# EAGLE schematic ARKnew (EAGLE 9.4.2)
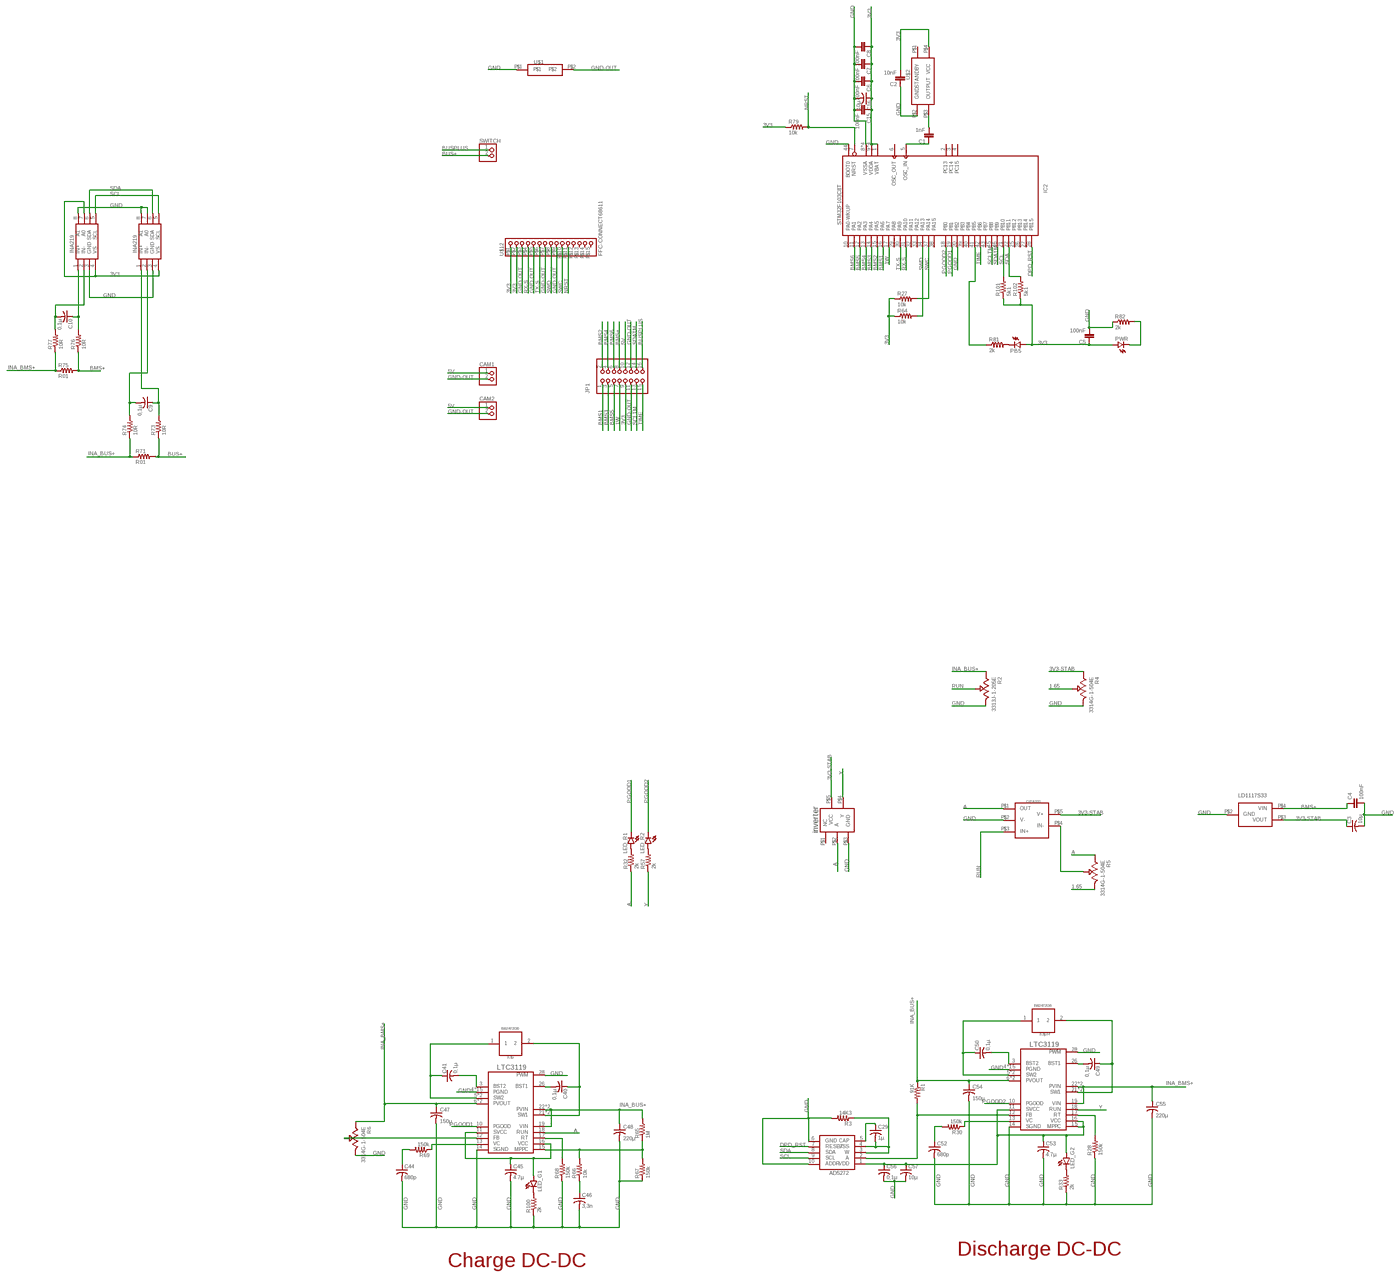
[diagram p0: schematic, sheet 1, overview]
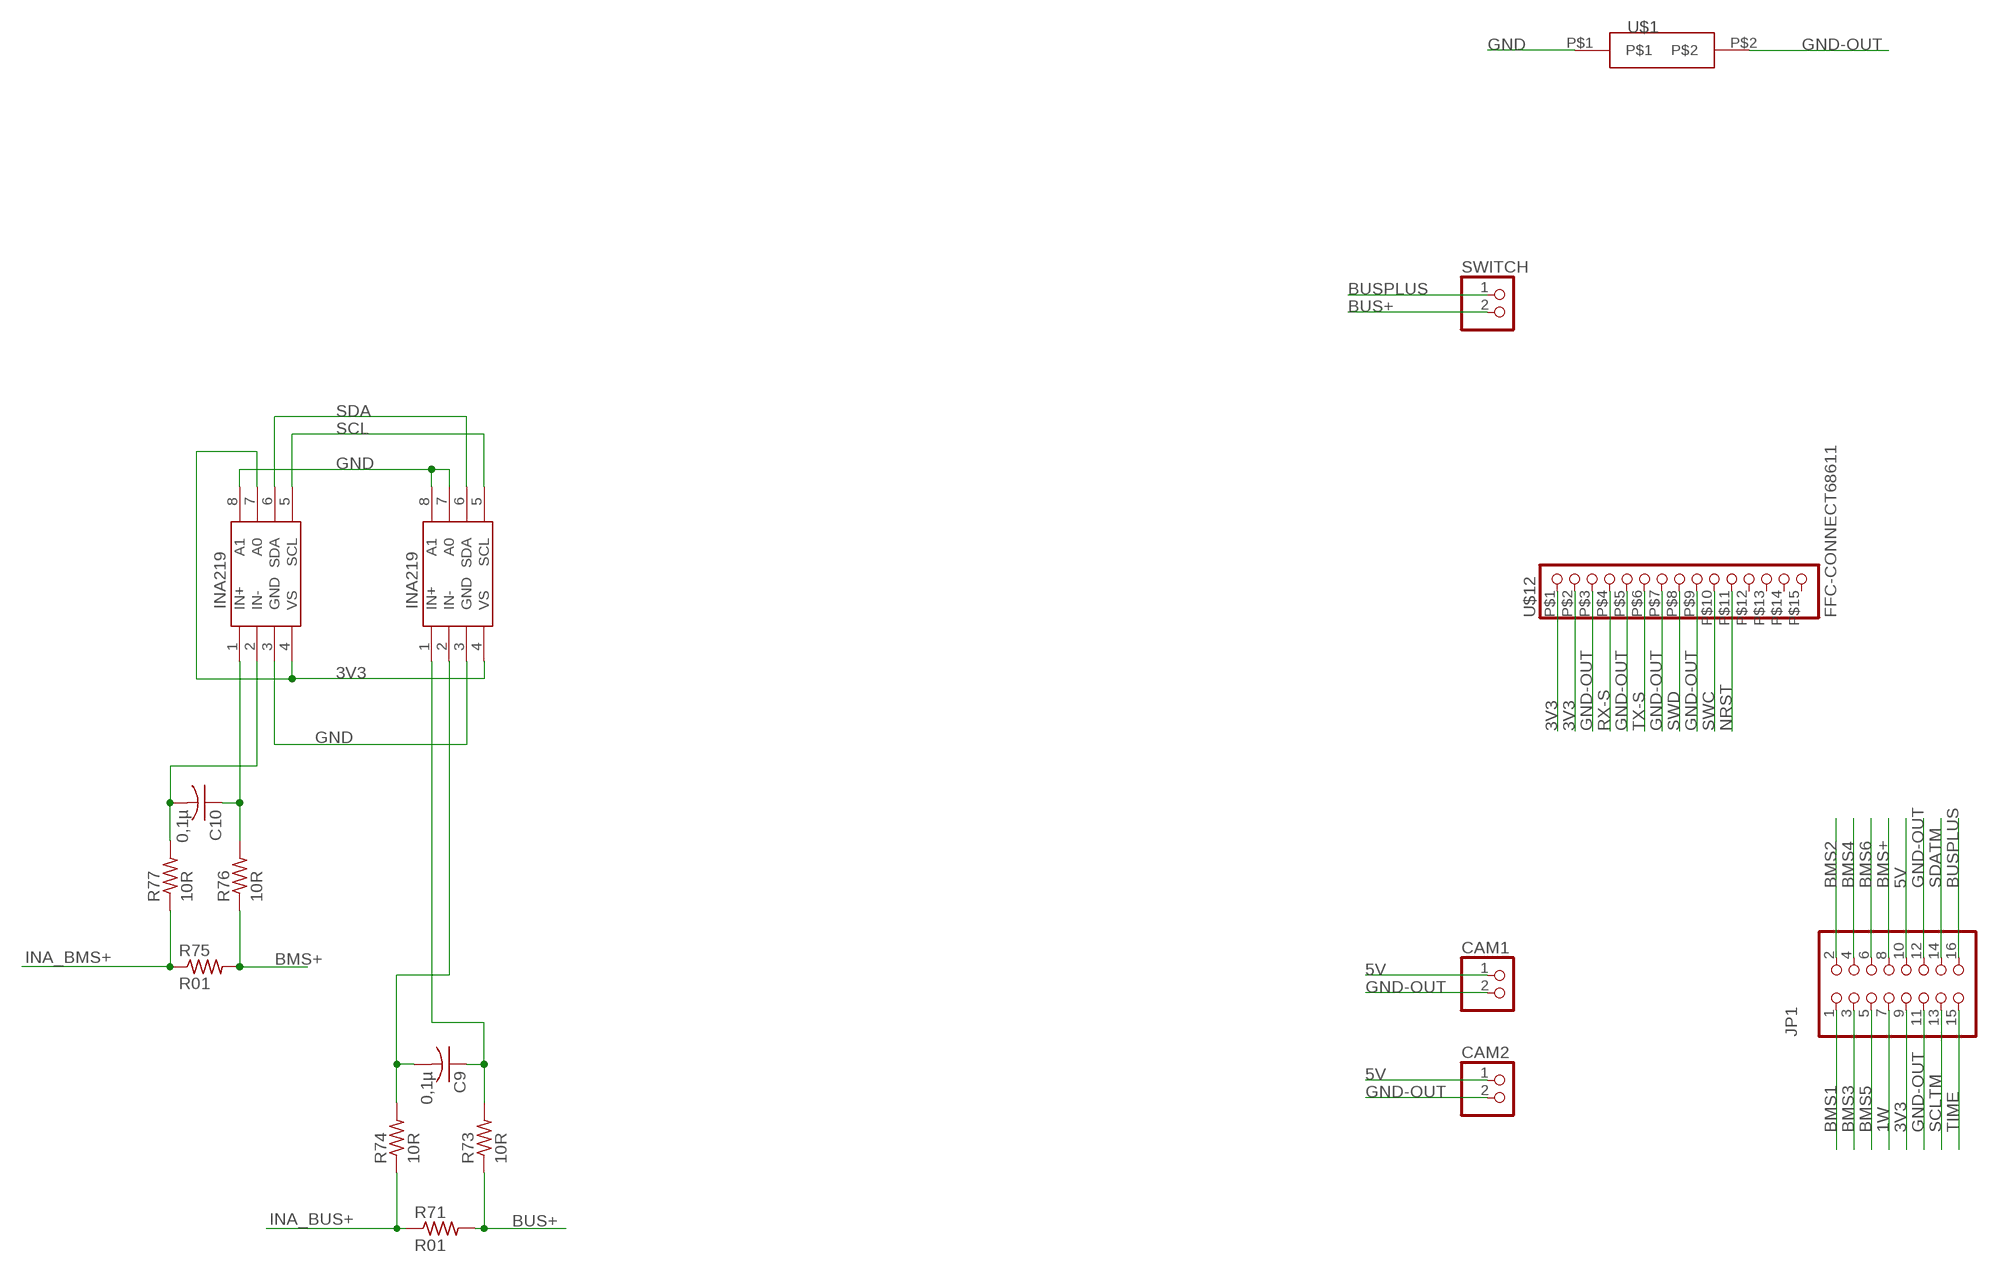
[diagram p1: schematic, sheet 1, part 1 of 4]
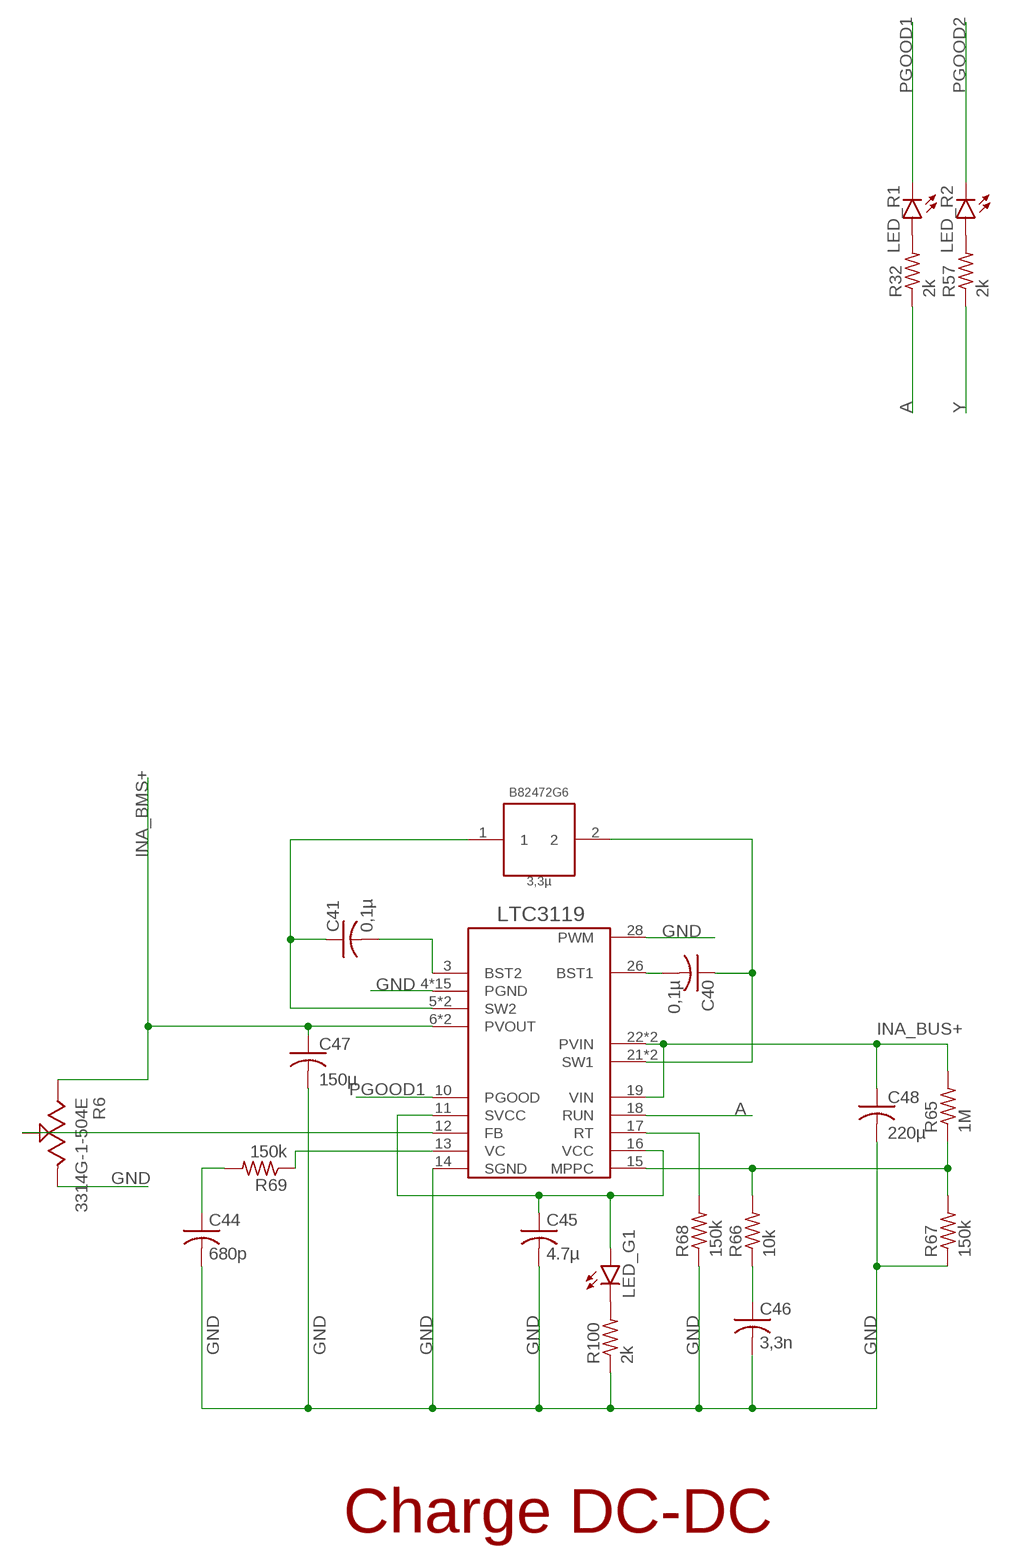
[diagram p2: schematic, sheet 1, part 2 of 4]
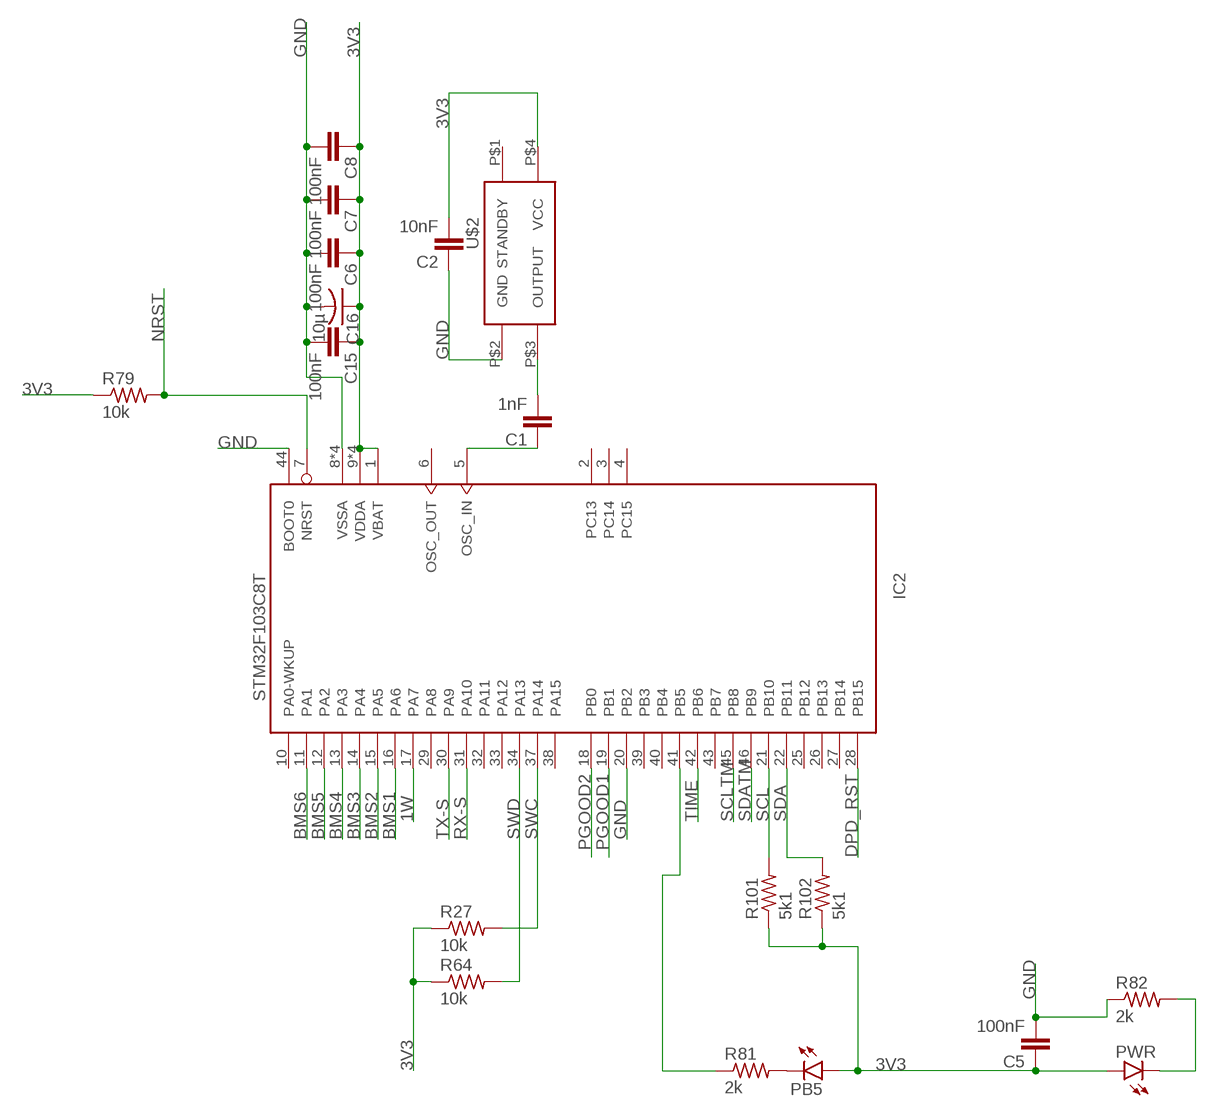
[diagram p3: schematic, sheet 1, part 3 of 4]
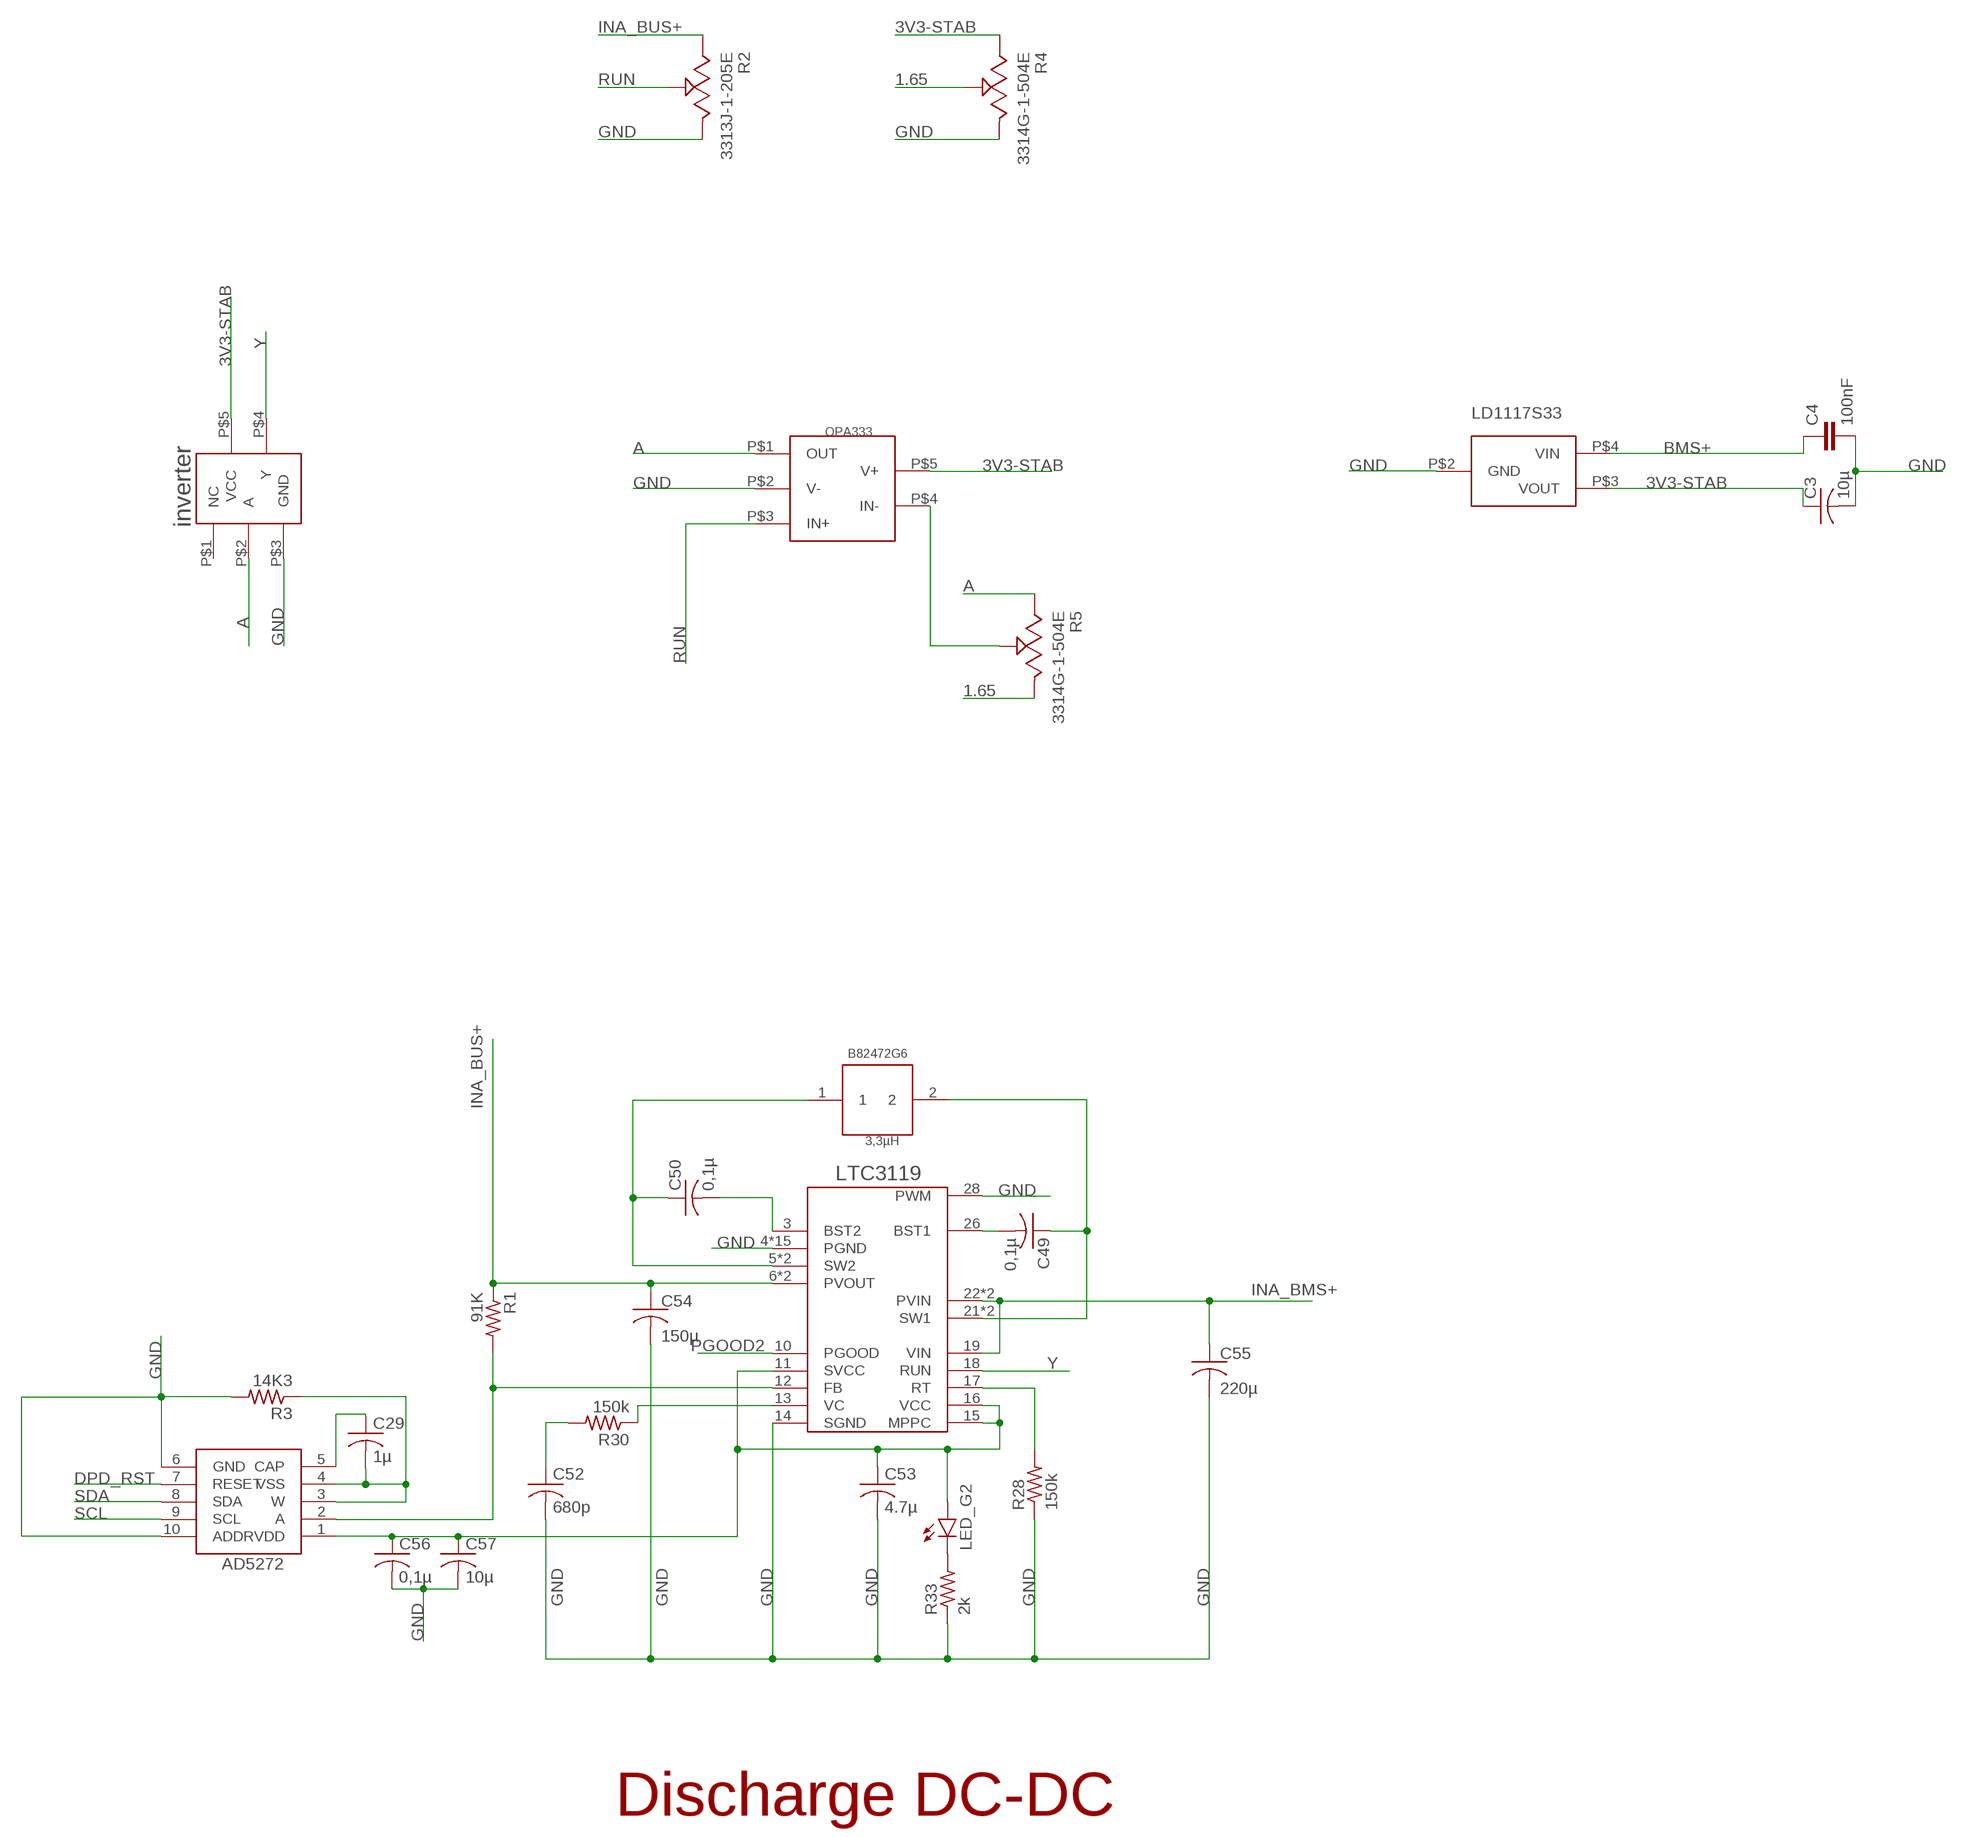
[diagram p4: schematic, sheet 1, part 4 of 4]

## Parts
3,3µH  3,3µ  B82472G6  [B82472G6]
3,3µH1  3,3µH  B82472G6  [B82472G6]
AD5272#2  AD5272  [MSOP10]
C1  1nF  C-EUC0603  [C0603]
C2  10nF  C-EUC0603  [C0603]
C3  10µ  C-USC1206  [C1206]
C4  100nF  C-EUC0603  [C0603]
C5  100nF  C-EUC0603  [C0603]
C6  100nF  C-EUC0603  [C0603]
C7  100nF  C-EUC0603  [C0603]
C8  100nF  C-EUC0603  [C0603]
C9  0,1µ  C-USC0603  [C0603]
C10  0,1µ  C-USC0603  [C0603]
C15  100nF  C-EUC0603  [C0603]
C16  10µ  C-USC1206  [C1206]
C29  1µ  C-USC0603  [C0603]
C40  0,1µ  C-USC0603  [C0603]
C41  0,1µ  C-USC0603  [C0603]
C44  680p  C-USC0603  [C0603]
C45  4.7µ  C-USC1206  [C1206]
C46  3,3n  C-USC0603  [C0603]
C47  150µ  ECAPECAP150  [ECAP150-CMD]
C48  220µ  ECAPECAP220  [ECAP220-CMD]
C49  0,1µ  C-USC0603  [C0603]
C50  0,1µ  C-USC0603  [C0603]
C52  680p  C-USC0603  [C0603]
C53  4.7µ  C-USC1206  [C1206]
C54  150µ  ECAPECAP150  [ECAP150-CMD]
C55  220µ  ECAPECAP220  [ECAP220-CMD]
C56  0,1µ  C-USC0603  [C0603]
C57  10µ  C-USC1206  [C1206]
CAM1  PINHD-1X2  [1X02]
CAM2  PINHD-1X2  [1X02]
IC2  STM32F103C8T  [LQFP48]
INA219#1  INA219AID  [SOT23-8]
INVERT  INVERTER.  [SC70]
JP1  PINHD-2X8  [2X08]
LD1117S33  LD1117S33  [SOT223]
LED_G1  LEDCHIPLED_0603  [CHIPLED_0603]
LED_G2  LEDCHIPLED_0603  [CHIPLED_0603]
LED_R1  LEDCHIPLED_0603  [CHIPLED_0603]
LED_R2  LEDCHIPLED_0603  [CHIPLED_0603]
OPA  OPA333  [SOT23-5]
PB5  LEDCHIPLED_0603  [CHIPLED_0603]
PWR  LEDCHIPLED_0603  [CHIPLED_0603]
R1  91K  R-US_R0603  [R0603]
R2  3313J-1-205E  [TRIM_3313J-1-205E]
R3  14K3  R-US_R0603  [R0603]
R4  3314G-1-504E  [TRIM_3314G-1-504E]
R5  3314G-1-504E  [TRIM_3314G-1-504E]
R6  3314G-1-504E  [TRIM_3314G-1-504E]
R27  10k  R-US_R0603  [R0603]
R28  150k  R-US_R0603  [R0603]
R30  150k  R-US_R0603  [R0603]
R32  2k  R-US_R0603  [R0603]
R33  2k  R-US_R0603  [R0603]
R57  2k  R-US_R0603  [R0603]
R64  10k  R-US_R0603  [R0603]
R65  1M  R-US_R0603  [R0603]
R66  10k  R-US_R0603  [R0603]
R67  150k  R-US_R0603  [R0603]
R68  150k  R-US_R0603  [R0603]
R69  150k  R-US_R0603  [R0603]
R71  R01  R-US_R2512  [R2512]
R73  10R  R-US_R0603  [R0603]
R74  10R  R-US_R0603  [R0603]
R75  R01  R-US_R2512  [R2512]
R76  10R  R-US_R0603  [R0603]
R77  10R  R-US_R0603  [R0603]
R79  10k  R-US_R0603  [R0603]
R81  2k  R-US_R0603  [R0603]
R82  2k  R-US_R0603  [R0603]
R100  2k  R-US_R0603  [R0603]
R101  5k1  R-US_R0603  [R0603]
R102  5k1  R-US_R0603  [R0603]
SWITCH  PINHD-1X2  [1X02]
U$1  MF-R400  [MF-R400]
U$2  Q24  [Q24]
U$12  FFC-CONNECT68611  [68611]
U$23  LTC31191  [LTC3119+VIA]
U$57  INA219AID  [SOT23-8]
U$59  LTC31191  [LTC3119+VIA]

## Nets
1.65: R4.2(WIPER) R5.3(CW)
1W: IC2.17(PA7) JP1.7
3V3: C2.2 C5.1 C6.1 C7.1 C8.1 C15.1 C16.1 IC2.1(VBAT) IC2.9(VDDA) IC2.24(VDDA) IC2.36(VDDA) IC2.48(VDDA) INA219#1.4(VS) JP1.9 PB5.A PWR.A R27.1 R64.1 R79.1 R101.1 R102.1 U$2.P$4(VCC) U$12.P$1 U$12.P$2 U$57.4(VS) U$57.7(A0)
3V3-STAB: C3.1 INVERT.P$5(VCC) LD1117S33.P$3(VOUT) OPA.P$5(V+) R4.1(CCW)
5V: CAM1.1 CAM2.1 JP1.10
90: R65.1 R66.2 R67.2 U$59.15(MPPC)
302: OPA.P$4(IN-) R5.2(WIPER)
A: INVERT.P$2(A) OPA.P$1(OUT) R5.1(CCW) R32.1 U$59.18(RUN)
BMS1: IC2.16(PA6) JP1.1
BMS2: IC2.15(PA5) JP1.2
BMS3: IC2.14(PA4) JP1.3
BMS4: IC2.13(PA3) JP1.4
BMS5: IC2.12(PA2) JP1.5
BMS6: IC2.11(PA1) JP1.6
BMS+: C4.1 JP1.8 LD1117S33.P$4(VIN) R75.2 R76.1
BUS+: R71.2 R73.1 SWITCH.2
BUSPLUS: JP1.16 SWITCH.1
DPD_RST: AD5272#2.7(RESET) IC2.28(PB15)
GND: AD5272#2.6(GND) AD5272#2.10(ADDR) C2.1 C3.2 C4.2 C5.2 C6.2 C7.2 C8.2 C15.2 C16.2 C44.2 C45.2 C46.2 C47.P$2 C48.P$2 C52.2 C53.2 C54.P$2 C55.P$2 C56.2 C57.2 IC2.8(VSSA) IC2.20(PB2) IC2.23(VSSA) IC2.35(VSSA) IC2.44(BOOT0) IC2.47(VSSA) INA219#1.3(GND) INA219#1.7(A0) INA219#1.8(A1) INVERT.P$3(GND) LD1117S33.P$2(GND) OPA.P$2(V-) R2.3(CW) R3.2 R4.3(CW) R6.3(CW) R28.1 R33.1 R67.1 R68.1 R82.1 R100.1 U$1.P$1 U$2.P$2(GND) U$23.4(PGND) U$23.9(PGND) U$23.14(SGND) U$23.20(PGND) U$23.25(PGND) U$23.28(PWM) U$23.29(PGND) U$23.P$1(PGND) U$23.P$2(PGND) U$23.P$3(PGND) U$23.P$4(PGND) U$23.P$5(PGND) U$23.P$6(PGND) U$23.P$7(PGND) U$23.P$8(PGND) U$23.P$9(PGND) U$23.P$10(PGND) U$57.3(GND) U$57.8(A1) U$59.4(PGND) U$59.9(PGND) U$59.14(SGND) U$59.20(PGND) U$59.25(PGND) U$59.28(PWM) U$59.29(PGND) U$59.P$1(PGND) U$59.P$2(PGND) U$59.P$3(PGND) U$59.P$4(PGND) U$59.P$5(PGND) U$59.P$6(PGND) U$59.P$7(PGND) U$59.P$8(PGND) U$59.P$9(PGND) U$59.P$10(PGND)
GND-OUT: CAM1.2 CAM2.2 JP1.11 JP1.12 U$1.P$2 U$12.P$3 U$12.P$5 U$12.P$7 U$12.P$9
INA_BMS+: C47.P$1 C55.P$1 R6.1(CCW) R75.1 R77.1 U$23.19(VIN) U$23.22(PVIN) U$23.23(PVIN) U$59.6(PVOUT) U$59.7(PVOUT)
INA_BUS+: C48.P$1 C54.P$1 R1.1 R2.1(CCW) R65.2 R71.1 R74.1 U$23.6(PVOUT) U$23.7(PVOUT) U$59.19(VIN) U$59.22(PVIN) U$59.23(PVIN)
N$1: C1.1 IC2.5(OSC_IN)
N$3: AD5272#2.2(A) R1.2 U$23.12(FB)
N$4: C1.2 U$2.P$3(OUTPUT)
N$14: C9.2 INA219#1.2(IN-) R74.2
N$17: PB5.C R81.2
N$48: AD5272#2.3(W) AD5272#2.4(VSS) C29.2 R3.1
N$51: AD5272#2.5(CAP) C29.1
N$77: 3,3µH1.2 C49.1 U$23.21(SW1) U$23.24(SW1)
N$78: 3,3µH1.1 C50.1 U$23.5(SW2) U$23.8(SW2)
N$79: R28.2 U$23.17(RT)
N$80: C49.2 U$23.26(BST1)
N$81: R30.1 U$23.13(VC)
N$82: C52.1 R30.2
N$84: C50.2 U$23.3(BST2)
N$85: LED_R1.A R32.2
N$87: LED_R2.A R57.2
N$89: R6.2(WIPER) U$59.12(FB)
N$91: LED_G1.C R100.2
N$92: LED_G2.C R33.2
N$129: C41.2 U$59.3(BST2)
N$131: 3,3µH.2 C40.1 U$59.21(SW1) U$59.24(SW1)
N$132: 3,3µH.1 C41.1 U$59.5(SW2) U$59.8(SW2)
N$135: R69.1 U$59.13(VC)
N$136: C44.1 R69.2
N$139: C46.1 R66.1
N$142: R68.2 U$59.17(RT)
N$144: C40.2 U$59.26(BST1)
N$147: C9.1 INA219#1.1(IN+) R73.2
N$150: C10.1 R76.2 U$57.1(IN+)
N$151: C10.2 R77.2 U$57.2(IN-)
N$159: PWR.C R82.2
N$161: IC2.41(PB5) R81.1
N$215: AD5272#2.1(VDD) C53.1 C56.1 C57.1 LED_G2.A U$23.11(SVCC) U$23.15(MPPC) U$23.16(VCC)
N$234: C45.1 LED_G1.A U$59.11(SVCC) U$59.16(VCC)
NRST: IC2.7(NRST) R79.2 U$12.P$11
PGOOD1: IC2.19(PB1) LED_R1.C U$59.10(PGOOD)
PGOOD2: IC2.18(PB0) LED_R2.C U$23.10(PGOOD)
RUN: OPA.P$3(IN+) R2.2(WIPER)
RX-S: IC2.31(PA10) U$12.P$4
SCL: AD5272#2.9(SCL) IC2.21(PB10) INA219#1.5(SCL) R101.2 U$57.5(SCL)
SCLTM: IC2.45(PB8) JP1.13
SDA: AD5272#2.8(SDA) IC2.22(PB11) INA219#1.6(SDA) R102.2 U$57.6(SDA)
SDATM: IC2.46(PB9) JP1.14
SWC: IC2.37(PA14) R27.2 U$12.P$10
SWD: IC2.34(PA13) R64.2 U$12.P$8
TIME: IC2.42(PB6) JP1.15
TX-S: IC2.30(PA9) U$12.P$6
Y: INVERT.P$4(Y) R57.1 U$23.18(RUN)
Unconnected: IC2.2(PC13) IC2.3(PC14) IC2.4(PC15) IC2.6(OSC_OUT) IC2.10(PA0-WKUP) IC2.25(PB12) IC2.26(PB13) IC2.27(PB14) IC2.29(PA8) IC2.32(PA11) IC2.33(PA12) IC2.38(PA15) IC2.39(PB3) IC2.40(PB4) IC2.43(PB7) INVERT.P$1(NC) U$2.P$1(STANDBY) U$12.P$12 U$12.P$13 U$12.P$14 U$12.P$15

## Notes on the sheet
- Discharge DC-DC
- Charge DC-DC

## Library data of the parts
3,3µH 3,3µH1 = CanCubeSat:B82472G6
AD5272#2 = CanCubeSat:AD5272
C1 C2 C4-C8 C15 = rcl:C-EU: CAPACITOR, European symbol; SPICEPREFIX: C
C3 C9 C10 C16 C29 C40 C41 C44-C46 C49 C50 C52 C53 C56 C57 = rcl:C-US: CAPACITOR, American symbol; SPICEPREFIX: C
C47 C48 C54 C55 = CanCubeSat:ECAP
CAM1 CAM2 SWITCH = pinheadCS:PINHD-1X2: PIN HEADER
IC2 = CanCubeSat:STM32F103C*T: ARM 32-bit Cortex™-M3 CPU 72 MHz maximum frequency 16 to 128 Kbytes of Flash memory 6 to 20 kbytes of SRAM 37 GPIOs 2.0 to 3.6 V application supply
INA219#1 U$57 = CanCubeSat:INA219AID
INVERT = CanCubeSat:INVERTER
JP1 = pinheadCS:PINHD-2X8: PIN HEADER
LD1117S33 = CanCubeSat:LD1117S33
LED_G1 LED_G2 LED_R1 LED_R2 PB5 PWR = led:LED: LED OSRAM: - CHIPLED LG R971, LG N971, LY N971, LG Q971, LY Q971, LO R971, LY R971 LH N974, LH R974 LS Q976, LO Q976, LY Q976 LO Q996 - Hyper CHIPLED LW Q18S LB Q993, LB Q99A, LB R99A - SideLED LS A670, LO A670, LY A670, LG A670, LP A670 LB A673, LV A673, LT A673, LW A673 LH A674 LY A675 LS A676, LA A676, LO A676, LY A676, LW A676 LS A679, LY A679, LG A679 - Hyper Micro SIDELED® LS Y876, LA Y876, LO Y876, LY Y876 LT Y87S - SmartLED LW L88C, LW L88S LB L89C, LB L89S, LG L890 LS L89K, LO L89K, LY L89K LS L896, LA L896, LO L896, LY L896 - TOPLED LS T670, LO T670, LY T670, LG T670, LP T670 LSG T670, LSP T670, LSY T670, LOP T670, LYG T670 LG T671, LOG T671, LSG T671 LB T673, LV T673, LT T673, LW T673 LH T674 LS T676, LA T676, LO T676, LY T676, LB T676, LH T676, LSB T676, LW T676 LB T67C, LV T67C, LT T67C, LS T67K, LO T67K, LY T67K, LW E67C LS E67B, LA E67B, LO E67B, LY E67B, LB E67C, LV E67C, LT E67C LW T67C LS T679, LY T679, LG T679 LS T770, LO T770, LY T770, LG T770, LP T770 LB T773, LV T773, LT T773, LW T773 LH T774 LS E675, LA E675, LY E675, LS T675 LS T776, LA T776, LO T776, LY T776, LB T776 LHGB T686 LT T68C, LB T68C - Hyper Mini TOPLED® LB M676 - Mini TOPLED Santana® LG M470 LS M47K, LO M47K, LY M47K Source: http://www.osram.convergy.de LUXEON: - LUMILED® LXK2-PW12-R00, LXK2-PW12-S00, LXK2-PW14-U00, LXK2-PW14-V00 LXK2-PM12-R00, LXK2-PM12-S00, LXK2-PM14-U00 LXK2-PE12-Q00, LXK2-PE12-R00, LXK2-PE12-S00, LXK2-PE14-T00, LXK2-PE14-U00 LXK2-PB12-K00, LXK2-PB12-L00, LXK2-PB12-M00, LXK2-PB14-N00, LXK2-PB14-P00, LXK2-PB14-Q00 LXK2-PR12-L00, LXK2-PR12-M00, LXK2-PR14-Q00, LXK2-PR14-R00 LXK2-PD12-Q00, LXK2-PD12-R00, LXK2-PD12-S00 LXK2-PH12-R00, LXK2-PH12-S00 LXK2-PL12-P00, LXK2-PL12-Q00, LXK2-PL12-R00 Source: www.luxeon.com KINGBRIGHT: KA-3528ASYC Source: www.kingbright.com
OPA = CanCubeSat:OPA333
R1 R3 R27 R28 R30 R32 R33 R57 R64-R69 R73 R74 R76 R77 R79 R81 R82 R100-R102 = resistor:R-US_: RESISTOR, American symbol
R2 = CanCubeSat:3313J-1-205E: 200 kOhms 0.125W, 1/8W J Lead Surface Mount Trimmer Potentiometer Cermet 1 Turn Top Adjustment Check prices <https://pricing.snapeda.com/parts/3313J-1-104E/Bourns/view-part?ref=eda>; AVAILABILITY: Good; DESCRIPTION: 100 kOhms 0.125W, 1/8W J Lead Surface Mount Trimmer Potentiometer Cermet 1 Turn Top Adjustment; MF: Bourns; MP: 3313J-1-104E; PACKAGE: 5025 Bourns; PRICE: None; PURCHASE-URL: https://pricing.snapeda.com/search/part/3313J-1-104E/?ref=eda
R4-R6 = CanCubeSat:3314G-1-504E
R71 R75 = rcl:R-US_: RESISTOR, American symbol; SPICEPREFIX: R
U$1 = CanCubeSat:MF-R400
U$2 = CanCubeSat:Q24
U$12 = CanCubeSat:FFC-CONNECT
U$23 U$59 = CanCubeSat:LTC3119